# Altium schematic sheet debugging_board_3_H-bridges.SchDoc
size A3
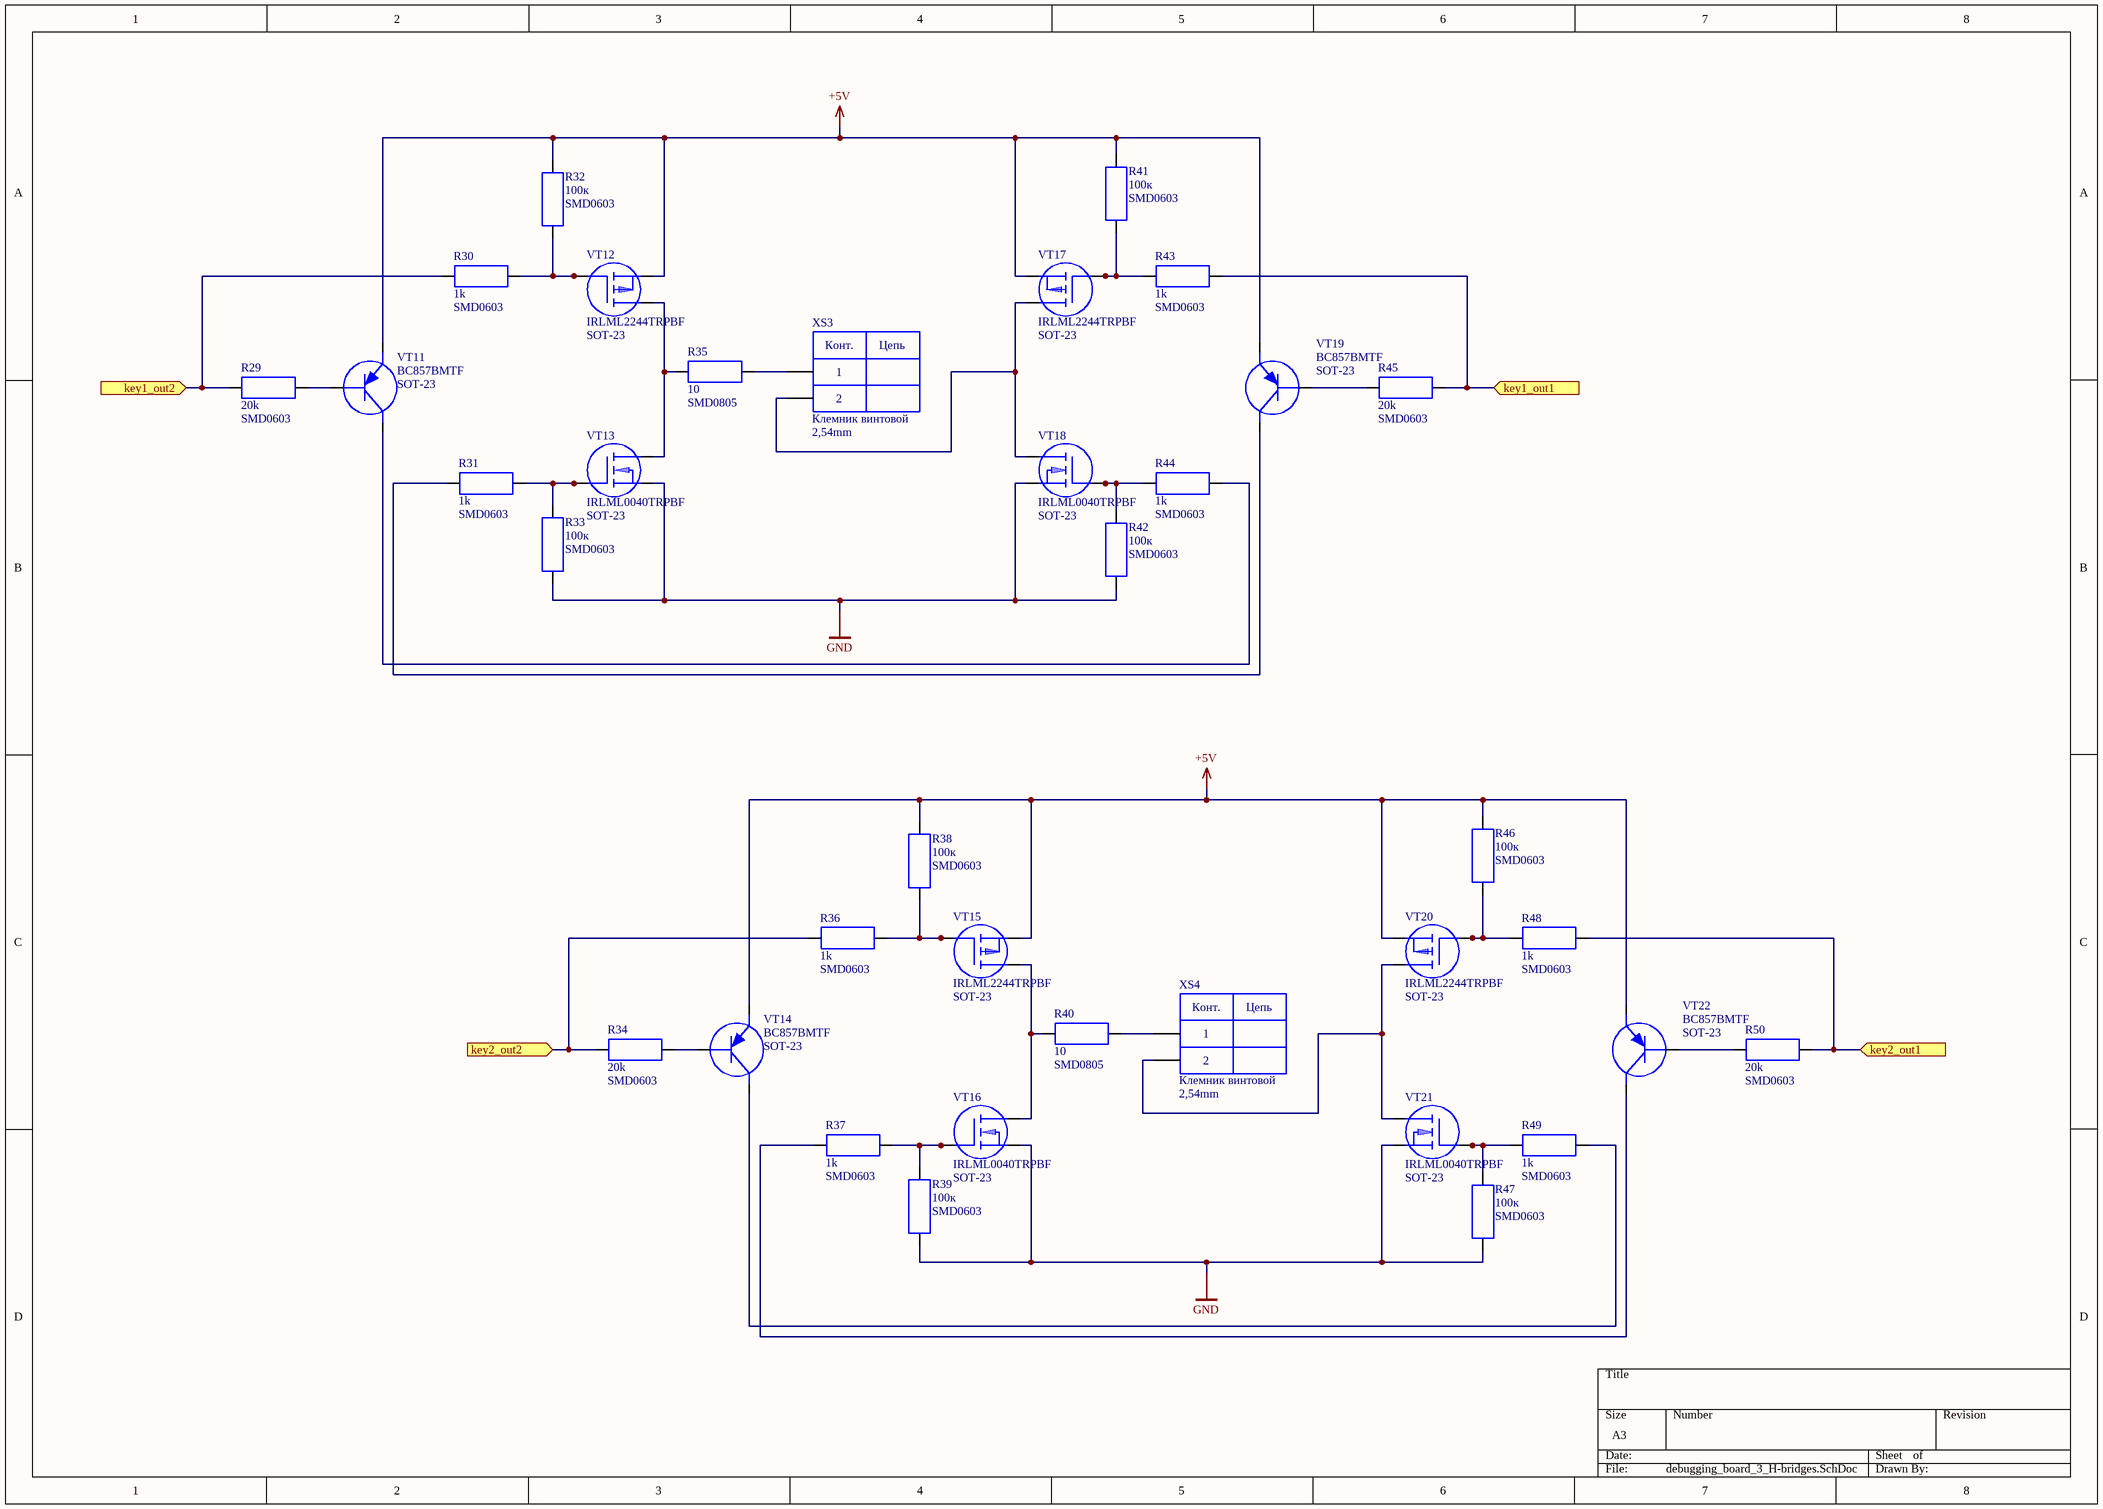
[diagram p0: debugging_board_3_H-bridges.SchDoc]

## Parts
R29  20k  Package: SMD0603  [SMD0603(1005)]
R30  1k  Package: SMD0603  [SMD0603(1005)]
R31  1k  Package: SMD0603  [SMD0603(1005)]
R32  100к  Package: SMD0603  [SMD0603(1005)]
R33  100к  Package: SMD0603  [SMD0603(1005)]
R34  20k  Package: SMD0603  [SMD0603(1005)]
R35  10  Package: SMD0805  [SMD0805(2012)]
R36  1k  Package: SMD0603  [SMD0603(1005)]
R37  1k  Package: SMD0603  [SMD0603(1005)]
R38  100к  Package: SMD0603  [SMD0603(1005)]
R39  100к  Package: SMD0603  [SMD0603(1005)]
R40  10  Package: SMD0805  [SMD0805(2012)]
R41  100к  Package: SMD0603  [SMD0603(1005)]
R42  100к  Package: SMD0603  [SMD0603(1005)]
R43  1k  Package: SMD0603  [SMD0603(1005)]
R44  1k  Package: SMD0603  [SMD0603(1005)]
R45  20k  Package: SMD0603  [SMD0603(1005)]
R46  100к  Package: SMD0603  [SMD0603(1005)]
R47  100к  Package: SMD0603  [SMD0603(1005)]
R48  1k  Package: SMD0603  [SMD0603(1005)]
R49  1k  Package: SMD0603  [SMD0603(1005)]
R50  20k  Package: SMD0603  [SMD0603(1005)]
VT11  BC857BMTF  Package: SOT-23  [SOT23-3]
VT12  IRLML2244TRPBF  Package: SOT-23  [SOT23-3]
VT13  IRLML0040TRPBF  Package: SOT-23  [SOT23-3]
VT14  BC857BMTF  Package: SOT-23  [SOT23-3]
VT15  IRLML2244TRPBF  Package: SOT-23  [SOT23-3]
VT16  IRLML0040TRPBF  Package: SOT-23  [SOT23-3]
VT17  IRLML2244TRPBF  Package: SOT-23  [SOT23-3]
VT18  IRLML0040TRPBF  Package: SOT-23  [SOT23-3]
VT19  BC857BMTF  Package: SOT-23  [SOT23-3]
VT20  IRLML2244TRPBF  Package: SOT-23  [SOT23-3]
VT21  IRLML0040TRPBF  Package: SOT-23  [SOT23-3]
VT22  BC857BMTF  Package: SOT-23  [SOT23-3]
XS3  Клемник винтовой  Package: 2,54mm  [XS_2x2.54MM]
XS4  Клемник винтовой  Package: 2,54mm  [XS_2x2.54MM]

## Ports
key1_out1 (in), key1_out2 (in), key2_out1 (in), key2_out2 (in)

## Nets
+5V: R32.2 R38.2 R41.2 R46.2 VT11.2 VT12.2 VT14.2 VT15.2 VT17.2 VT19.2 VT20.2 VT22.2
GND: R33.1 R39.1 R42.1 R47.1 VT13.2 VT16.2 VT18.2 VT21.2
key1_out1: R43.1 R45.2 ; port key1_out1
key1_out2: R29.1 R30.2 ; port key1_out2
key2_out1: R48.1 R50.2 ; port key2_out1
key2_out2: R34.1 R36.2 ; port key2_out2
NetR29_2: R29.2 VT11.1
NetR30_1: R30.1 R32.1 VT12.1
NetR31_1: R31.1 R33.2 VT13.1
NetR31_2: R31.2 VT19.3
NetR34_2: R34.2 VT14.1
NetR35_1: R35.1 XS3.1
NetR35_2: R35.2 VT12.3 VT13.3
NetR36_1: R36.1 R38.1 VT15.1
NetR37_1: R37.1 R39.2 VT16.1
NetR37_2: R37.2 VT22.3
NetR40_1: R40.1 XS4.1
NetR40_2: R40.2 VT15.3 VT16.3
NetR41_1: R41.1 R43.2 VT17.1
NetR42_2: R42.2 R44.2 VT18.1
NetR44_1: R44.1 VT11.3
NetR45_1: R45.1 VT19.1
NetR46_1: R46.1 R48.2 VT20.1
NetR47_2: R47.2 R49.2 VT21.1
NetR49_1: R49.1 VT14.3
NetR50_1: R50.1 VT22.1
NetVT17_3: VT17.3 VT18.3 XS3.2
NetVT20_3: VT20.3 VT21.3 XS4.2

## Notes on the sheet
- (in symbol Клемник винтовой 2-контактный, 2,54мм) Конт.; Цепь

## Library data of the parts
R29 R34 R45 R50 = R_0603: ValueBOM: Резистор 20кОм SMD 0603 1%; Type: R; Value: 20k
R30 R31 R36 R37 R43 R44 R48 R49 = R_0603: ValueBOM: Резистор 1кОм SMD 0603 1%; Type: R; Value: 1k
R32 R33 R38 R39 R41 R42 R46 R47 = R_0603: ValueBOM: Резистор 100кОм SMD 0603 1%; Type: R; Value: 100к
R35 R40 = R_0805: ValueBOM: Резистор 10 Ом SMD 0805 1%; Type: R; Value: 10
VT11 VT14 VT19 VT22 = VT_PNP_SOT23_3: Type: VT; ValueBOM: Транзистор биполярный PNP BC857BMTF SOT23; Value: BC857BMTF
VT12 VT15 VT17 VT20 = VT_P_MOSFET_SOT23_3: Type: VT; ValueBOM: Транзистор p-МОП IRLML2244TRPBF SOT23; Value: IRLML2244TRPBF
VT13 VT16 VT18 VT21 = VT_N_MOSFET_SOT23_3: Type: VT; ValueBOM: Транзистор n-МОП IRLML0040TRPBF SOT23; Value: IRLML0040TRPBF
XS3 XS4 = Клемник винтовой 2-контактный, 2,54мм: ValueBOM: 308-021-14, Клеммник винтовой, 2-контактный, 2.54мм, прямой; Type: XS; Value: Клемник винтовой